# Altium schematic sheet EnviromentalElements.SchDoc
size A3; DocumentNumber: 5; SheetNumber: 5; SheetTotal: 5
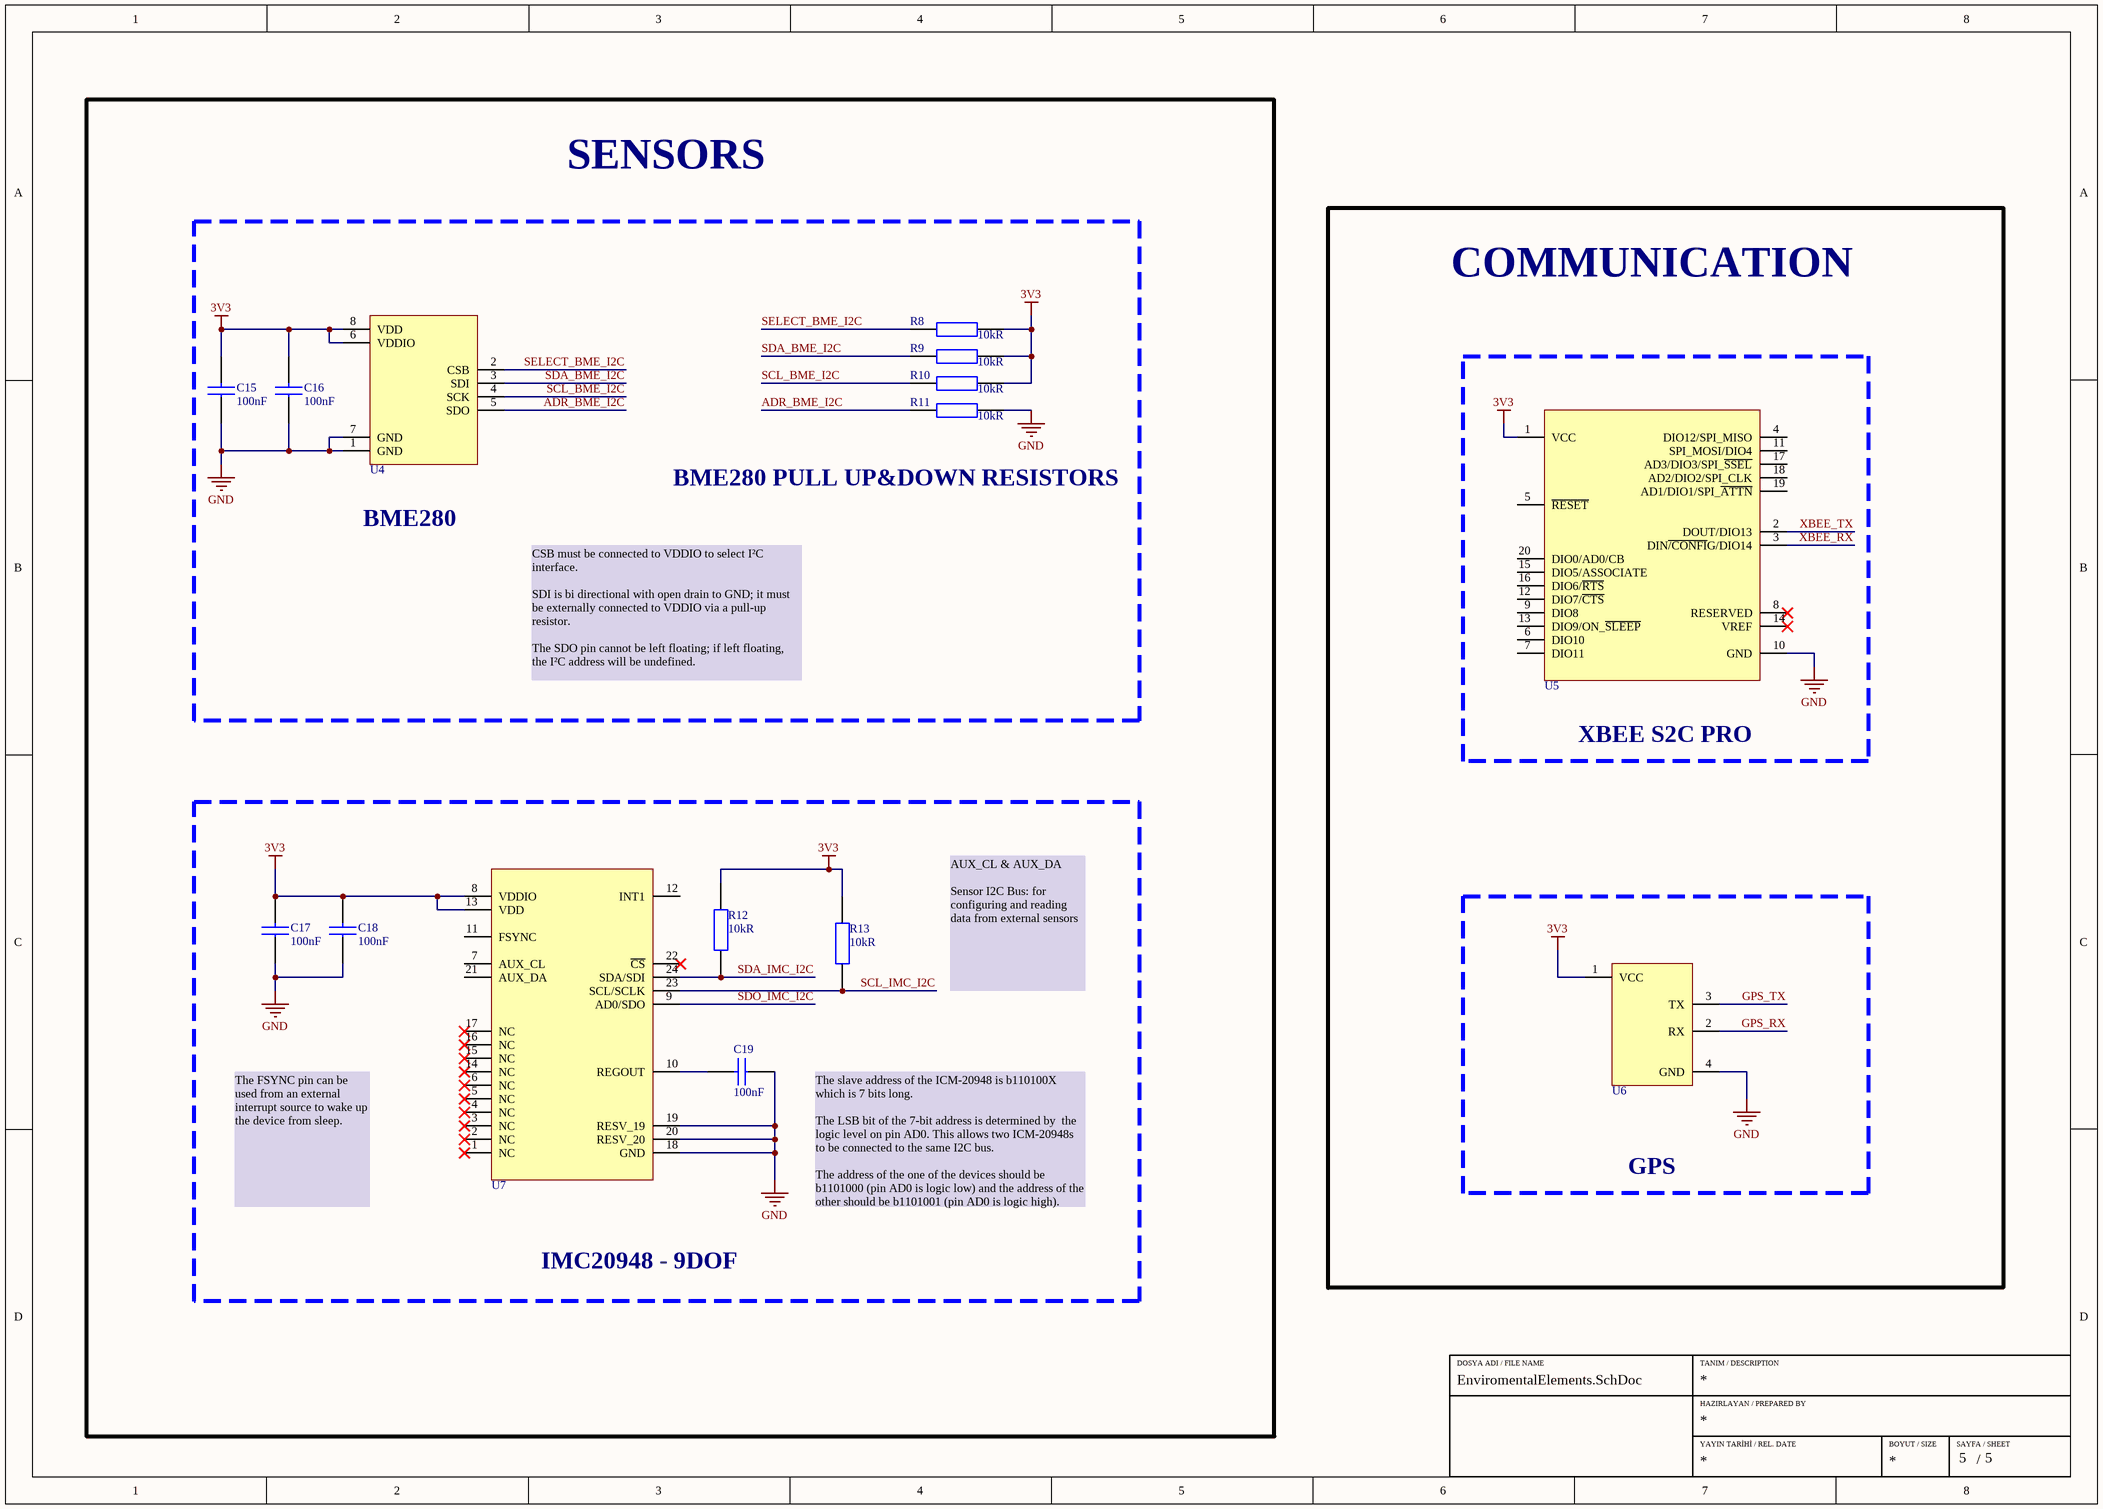
[diagram p0: EnviromentalElements.SchDoc]

## Parts
C15  Capacitance: 100nF  [CAP_0603]  (hidden comment: C0603C104K5RACTU)
C16  Capacitance: 100nF  [CAP_0603]  (hidden comment: C0603C104K5RACTU)
C17  Capacitance: 100nF  [CAP_0603]  (hidden comment: C0603C104K5RACTU)
C18  Capacitance: 100nF  [CAP_0603]  (hidden comment: C0603C104K5RACTU)
C19  Capacitance: 100nF  [CAP_0603]  (hidden comment: C0603C104K5RACTU)
R8  Resistance: 10kR  [RES_0603]  (hidden comment: RC0603FR-0710KL)
R9  Resistance: 10kR  [RES_0603]  (hidden comment: RC0603FR-0710KL)
R10  Resistance: 10kR  [RES_0603]  (hidden comment: RC0603FR-0710KL)
R11  Resistance: 10kR  [RES_0603]  (hidden comment: RC0603FR-0710KL)
R12  Resistance: 10kR  [RES_0603]  (hidden comment: RC0603FR-0710KL)
R13  Resistance: 10kR  [RES_0603]  (hidden comment: RC0603FR-0710KL)
U4  BME280  [8-VFLGA]  (value not drawn)
U5  XBEE S2C PRO  [XBEE_S2C_PRO]  (value not drawn)
U6  GY-NEO6MV2  [GY-NEO6MV2]  (value not drawn)
U7  ICM-20948  [24-TFQFN Module Exposed Pad]  (value not drawn)

## Blocks framed on the sheet
SENSORS: C15 C16 R8-R11 U4
XBEE S2C PRO: U5
IMC20948 - 9DOF: C17-C19 R12 R13 U7
GPS: U6

## Nets
3V3: C15.2 C16.2 C17.2 C18.2 R8.2 R9.2 R10.2 R12.2 R13.2 U4.6(VDDIO) U4.8(VDD) U5.1(VCC) U6.1(VCC) U7.8(VDDIO) U7.13(VDD)
GND: C15.1 C16.1 C17.1 C18.1 C19.1 R11.2 U4.1(GND) U4.7(GND) U5.10(GND) U6.4(GND) U7.18(GND) U7.19(RESV_19) U7.20(RESV_20)
ADR_BME_I2C: R11.1 U4.5(SDO)
GPS_RX: U6.2(RX)
GPS_TX: U6.3(TX)
SCL_BME_I2C: R10.1 U4.4(SCK)
SCL_IMC_I2C: R13.1 U7.23(SCL/SCLK)
SDA_BME_I2C: R9.1 U4.3(SDI)
SDA_IMC_I2C: R12.1 U7.24(SDA/SDI)
SDO_IMC_I2C: U7.9(AD0/SDO)
SELECT_BME_I2C: R8.1 U4.2(CSB)
XBEE_RX: U5.3(DIN~{/CONFI}G/DIO14)
XBEE_TX: U5.2(DOUT/DIO13)
NetC19_2: C19.2 U7.10(REGOUT)

Not connected (* = marked no-connect by the designer): U5 4(DIO12/SPI_MISO) 5(~{RESET}) 6(DIO10) 7(DIO11) 8(RESERVED)* 9(DIO8) 11(SPI_MOSI/DIO4) 12(DIO7/~{CTS}) 13(DIO9/ON_~{SLEEP}) 14(VREF)* 15(DIO5/ASSOCIATE) 16(DIO6/~{RTS}) 17(AD3/DIO3/SPI_~{SSEL}) 18(AD2/DIO2/SPI_CLK) 19(AD1/DIO1/SPI_~{ATTN}) 20(DIO0/AD0/CB); U7 1(NC)* 2(NC)* 3(NC)* 4(NC)* 5(NC)* 6(NC)* 7(AUX_CL) 11(FSYNC) 12(INT1) 14(NC)* 15(NC)* 16(NC)* 17(NC)* 21(AUX_DA) 22(~{CS})*

## Notes on the sheet
- COMMUNICATION
- BME280
- BME280 PULL UP&DOWN RESISTORS
- CSB must be connected to VDDIO to select I²C interface.
  SDI is bi directional with open drain to GND; it must be externally connected to VDDIO via a pull-up resistor.
  The SDO pin cannot be left floating; if left floating, the I²C address will be undefined.
- AUX_CL & AUX_DA
  Sensor I2C Bus: for configuring and reading data from external sensors
- The FSYNC pin can be used from an external interrupt source to wake up the device from sleep.
- The slave address of the ICM-20948 is b110100X which is 7 bits long.
  The LSB bit of the 7-bit address is determined by  the logic level on pin AD0. This allows two ICM-20948s to be connected to the same I2C bus.
  The address of the one of the devices should be b1101000 (pin AD0 is logic low) and the address of the other should be b1101001 (pin AD0 is logic high).
- DOSYA ADI / FILE NAME
- TANIM / DESCRIPTION
- HAZIRLAYAN / PREPARED BY
- YAYIN TARİHİ / REL. DATE
- BOYUT / SIZE
- SAYFA / SHEET
- /

## Library data of the parts
C15-C19 = CAP CER 100nF 0603: CAP CER 100nF %10 0603 SMD; Manufacturer: KEMET; DesignedBy: Aslı Kurt; Dielectric Material: Ceramic; Voltage Rating (DC): 50V; Tolerance: 10%; Dielectric: X7R; Dissipation Factor: 2.5%; Supplier 1: Digi-Key; Manufacturer Part Number: C0603C104K5RACTU; RoHS: Yes; Category: Ceramic Capacitors; Stock 1: 1666186; Pricing 1: 1=0,12000, 10=0,08500, 50=0,04620, 100=0,03770, 500=0,02696, 1000=0,02118 (USD); Mount: Surface Mount; Case/Package: 0603; Number of Pins: 2; Case Code (Metric): 1608; Case Code (Imperial): 0603; Contact Plating: Tin,Matte; Min Operating Temperature: -55°C; Max Operating Temperature: 125°C; Packaging: Tape and Reel; Package Quantity: 1; Termination: SMD/SMT; Voltage: 50V; Voltage Rating: 50V; Series: SMD Comm X7R; Length: 0.063inch; Width: 0.031inch; Height: 0.8mm; Thickness: 0.034inch; Lead Pitch: 0.7mm; Depth: 0.8mm; Radiation Hardening: No; RoHS Compliant: Yes; REACH SVHC: No SVHC; ComponentLink1URL: https://datasheet.ciiva.com/7823/kem-c1002-x7r-smd-7823591.pdf?src-supplier=Element14; ComponentLink1Description: https://datasheet.ciiva.com/7823/kem-c1002-x7r-smd-7823591.pdf?src-supplier=Element14; ComponentLink2URL: https://datasheet.ciiva.com/14602/70095383-14602583.pdf?src-supplier=Allied+Electronics; ComponentLink2Description: https://datasheet.ciiva.com/14602/70095383-14602583.pdf?src-supplier=Allied+Electronics; ComponentLink3URL: https://datasheet.ciiva.com/5999/kem-c1002-x7r-smd-5999400.pdf?src-supplier=Farnell; ComponentLink3Description: https://datasheet.ciiva.com/5999/kem-c1002-x7r-smd-5999400.pdf?src-supplier=Farnell; ComponentLink4URL: https://datasheet.ciiva.com/7823/kem-c1002-x7r-smd-7823592.pdf?src-supplier=Element14; ComponentLink4Description: https://datasheet.ciiva.com/7823/kem-c1002-x7r-smd-7823592.pdf?src-supplier=Element14; ComponentLink5URL: https://datasheet.ciiva.com/28645/1851736-28645640.pdf?src-supplier=Element14; ComponentLink5Description: https://datasheet.ciiva.com/28645/1851736-28645640.pdf?src-supplier=Element14; ComponentLink6URL: https://datasheet.ciiva.com/14585/70095383-14585209.pdf?src-supplier=Allied+Electronics; ComponentLink6Description: https://datasheet.ciiva.com/14585/70095383-14585209.pdf?src-supplier=Allied+Electronics; Supplier Part Number 1: 399-5089-1-ND
R8-R13 = RES 10K OHM 0603: RES 10K %1 OHM 0603 SMD; Manufacturer: Yageo; DesignedBy: Aslı Kurt; Tolerance: 1%; Temperature Coefficient: 100ppm/°C; Voltage Rating (DC): 50V; Power Rating: 100mW; Voltage Rating: 75V; Supplier 1: Digi-Key; Manufacturer Part Number: RC0603FR-0710KL; RoHS: Yes; Category: Chip SMD Resistors; Stock 1: 24140601; Pricing 1: 1=0,10000, 10=0,02300, 100=0,00930, 1000=0,00417, 2500=0,00362 (USD); Case/Package: 0603; Number of Pins: 2; Case Code (Imperial): 0603; Case Code (Metric): 1608; Weight: 7.1E-05oz; Size Code: 0603; Min Operating Temperature: -55°C; Max Operating Temperature: 155°C; Resistor Type: Thick Film; Packaging: Tape and Reel; Termination: SMD/SMT; Features: Moisture Resistant; Series: RC; Max Power Dissipation: 100mW; Number of Terminations: 2; Resistance Tolerance: 1%; Construction: Rectangular; Length: 1.6mm; Width: 0.8mm; Height: 0.45mm; Depth: 0.8mm; Lead Pitch: 0.3mm; REACH SVHC: Unknown; Lead Free: Lead Free; Military Standard: Not; RoHS Compliant: Yes; ComponentLink1URL: https://datasheet.ciiva.com/7660/38590-7660789.pdf?src-supplier=Element14; ComponentLink1Description: https://datasheet.ciiva.com/7660/38590-7660789.pdf?src-supplier=Element14; ComponentLink2URL: https://datasheet.ciiva.com/15189/getdatasheetpartid-409289-15189591.pdf?src-supplier=Verical; ComponentLink2Description: https://datasheet.ciiva.com/15189/getdatasheetpartid-409289-15189591.pdf?src-supplier=Verical; ComponentLink3URL: https://datasheet.ciiva.com/46440/1868787-46440891.pdf?src-supplier=Element14; ComponentLink3Description: https://datasheet.ciiva.com/46440/1868787-46440891.pdf?src-supplier=Element14; ComponentLink4URL: https://datasheet.ciiva.com/7983/443971-7983596.pdf?src-supplier=Element14; ComponentLink4Description: https://datasheet.ciiva.com/7983/443971-7983596.pdf?src-supplier=Element14; ComponentLink5URL: https://datasheet.ciiva.com/7746/1738695-7746239.pdf?src-supplier=Element14; ComponentLink5Description: https://datasheet.ciiva.com/7746/1738695-7746239.pdf?src-supplier=Element14; ComponentLink6URL: https://datasheet.ciiva.com/22747/443971-22747519.pdf?src-supplier=Element14; ComponentLink6Description: https://datasheet.ciiva.com/22747/443971-22747519.pdf?src-supplier=Element14; Supplier Part Number 1: 311-10.0KHRCT-ND
U4 = BME280: Pressure, Temperature and Humidity Sensor Digital Output 1.8V 8-Pin LGA T/R; Manufacturer: Bosch; DesignedBy: Aslı Kurt; Supplier 1: Future Electronics; Manufacturer Part Number: BME280; RoHS: No; Category: Temperature and Humidity Sensors; Stock 1: 1497; Pricing 1: 1=4,57, 20=4,16, 150=3,89, 1000=3,63, 5000=3,41 (USD); ComponentLink1URL: https://ae-bst.resource.bosch.com/media/_tech/media/product_flyer/BME280_Productflyer_BST_20170109.pdf?src-supplier=Arrow+Electronics; ComponentLink1Description: https://ae-bst.resource.bosch.com/media/_tech/media/product_flyer/BME280_Productflyer_BST_20170109.pdf?src-supplier=Arrow+Electronics; ComponentLink2URL: https://ae-bst.resource.bosch.com/media/_tech/media/datasheets/BST-BME280-DS002.pdf?src-supplier=Digikey; ComponentLink2Description: https://ae-bst.resource.bosch.com/media/_tech/media/datasheets/BST-BME280-DS002.pdf?src-supplier=Digikey; ComponentLink3URL: https://ae-bst.resource.bosch.com/media/_tech/media/product_flyer/BME280_Productflyer_BST_20170109.pdf?src-supplier=Mouser; ComponentLink3Description: https://ae-bst.resource.bosch.com/media/_tech/media/product_flyer/BME280_Productflyer_BST_20170109.pdf?src-supplier=Mouser; ComponentLink4URL: https://ae-bst.resource.bosch.com/media/_tech/media/product_flyer/BME280_Productflyer_BST_20170109.pdf?src-supplier=NAC+Semi; ComponentLink4Description: https://ae-bst.resource.bosch.com/media/_tech/media/product_flyer/BME280_Productflyer_BST_20170109.pdf?src-supplier=NAC+Semi; ComponentLink5URL: https://datasheet.octopart.com/BME280-Bosch-Sensortec-datasheet-119732019.pdf?src-supplier=LKR; ComponentLink5Description: https://datasheet.octopart.com/BME280-Bosch-Sensortec-datasheet-119732019.pdf?src-supplier=LKR; Supplier 2: Future Electronics; Supplier Part Number 1: 2053946; Pricing 2: 10000=2,68 (USD); Supplier Part Number 2: 9052452
U5 = XB24CASIT-001: XBee S2C 802.15.4, 2.4GHz TH (RPSMA); Manufacturer: Digi International; DesignedBy: Aslı Kurt; Interface: SPI,UART; Data Rate: 1Mbps; Sensitivity: -102dBm; Current - Receiving: 31mA; Current - Transmitting: 45mA; Supplier 1: Rs; Manufacturer Part Number: XB24CASIT-001; RoHS: No; Category: RF Receivers, Transceivers; Stock 1: 10; Pricing 1: 1=39,95, 5=35,94, 10=32,4 (GBP); Mount: Through Hole; Case/Package: Module; Min Operating Temperature: -40°C; Max Operating Temperature: 85°C; Packaging: Tray; Frequency: 2.4GHz; Series: XBee®; ComponentLink1URL: https://www.digi.com/resources/documentation/digidocs/pdfs/90001500.pdf?src-supplier=Digikey; ComponentLink1Description: https://www.digi.com/resources/documentation/digidocs/pdfs/90001500.pdf?src-supplier=Digikey; Supplier 2: Digikey; Stock 2: 198; Pricing 2: 1=29,33 (USD); Supplier 3: Mouser; Pricing 3: 1=29,33, 10=29,33, 50=29,33, 100=29,33, 1000=29,33, 10000=29,33 (USD); Supplier 4: Avnet; Pricing 4: 25=29,33 (USD); Supplier 5: Arrow Electronics; Pricing 5: 25=25,77 (USD); Supplier Part Number 1: 1359726; Supplier Part Number 2: 602-1894-ND; Supplier Part Number 3: 888-XB24CASIT-001; Supplier Part Number 4: XB24CASIT-001; Supplier Part Number 5: XB24CASIT-001
U6 = GY-NEO6MV2: GY-NEO6MV2 GPS Modülü - Uçuş Kontrol Sistem GPS'i; DesignedBy: Aslı Kurt; ComponentLink1Description: Dataheet; ComponentLink1URL: https://www.rlocman.ru/i/File/2011/04/22/1.pdf
U7 = ICM-20948: Accelerometer and Gyroscope Compass 9-Axis Digital 24-Pin QFN T/R; Manufacturer: TDK; Sensor Type: Accelerometer,Gyroscope,Magnetometer; Output Type: SPI,I2C; Max Supply Voltage: 3.6V; Min Supply Voltage: 1.71V; DesignedBy: Aslı Kurt; Supplier 1: Mouser; Manufacturer Part Number: ICM-20948; RoHS: Yes; Category: Linear ICs; Stock 1: 25494; Pricing 1: 1=7,87, 10=6,16, 50=6,16, 100=5,59, 1000=4,49, 10000=4,17 (USD); Mount: Surface Mount; Case/Package: QFN; Min Operating Temperature: -40°C; Max Operating Temperature: 85°C; Series: -; Packaging: Cut Tape; Length: 3mm; Width: 3mm; Height: 1.05mm; ComponentLink1URL: http://www.farnell.com/datasheets/2632662.pdf?src-supplier=Farnell; ComponentLink1Description: http://www.farnell.com/datasheets/2632662.pdf?src-supplier=Farnell; ComponentLink2URL: https://www.invensense.com/wp-content/uploads/2016/06/App-Note-eMD-20x48-User-Guide.pdf?src-supplier=Digikey; ComponentLink2Description: https://www.invensense.com/wp-content/uploads/2016/06/App-Note-eMD-20x48-User-Guide.pdf?src-supplier=Digikey; ComponentLink3URL: http://www.farnell.com/datasheets/2632662.pdf?src-supplier=Element14; ComponentLink3Description: http://www.farnell.com/datasheets/2632662.pdf?src-supplier=Element14; ComponentLink4URL: http://www.farnell.com/datasheets/2632662.pdf?src-supplier=Newark; ComponentLink4Description: http://www.farnell.com/datasheets/2632662.pdf?src-supplier=Newark; ComponentLink5URL: https://www.invensense.com/wp-content/uploads/2016/06/App-Note-eMD-20x48-User-Guide.pdf?src-supplier=Avnet; ComponentLink5Description: https://www.invensense.com/wp-content/uploads/2016/06/App-Note-eMD-20x48-User-Guide.pdf?src-supplier=Avnet; ComponentLink6URL: https://www.invensense.com/wp-content/uploads/2016/06/App-Note-eMD-20x48-User-Guide.pdf?src-supplier=Component+Distributors+Inc.; ComponentLink6Description: https://www.invensense.com/wp-content/uploads/2016/06/App-Note-eMD-20x48-User-Guide.pdf?src-supplier=Component+Distributors+Inc.; Supplier Part Number 1: 410-ICM-20948